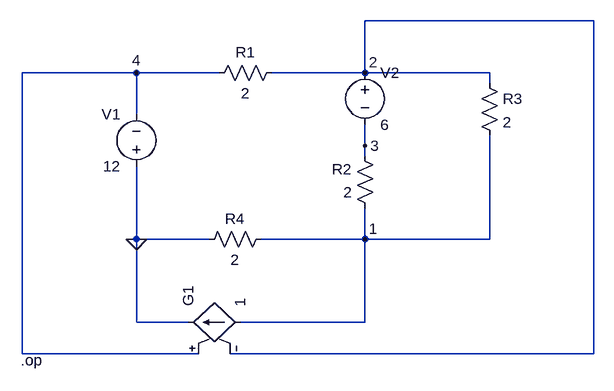
[diagram p0: schematic ex3.asc]
ex3.asc, the LTspice schematic file:
Version 4
SHEET 1 880 680
WIRE 544 -16 192 -16
WIRE -160 64 -336 64
WIRE -32 64 -160 64
WIRE 192 64 192 -16
WIRE 192 64 48 64
WIRE 384 64 192 64
WIRE 384 80 384 64
WIRE -160 128 -160 64
WIRE 192 176 192 144
WIRE 192 192 192 176
WIRE -160 320 -160 208
WIRE -48 320 -160 320
WIRE 192 320 192 272
WIRE 192 320 32 320
WIRE 384 320 384 160
WIRE 384 320 192 320
WIRE -160 448 -160 320
WIRE -80 448 -160 448
WIRE 192 448 192 320
WIRE 192 448 0 448
WIRE -336 496 -336 64
WIRE -64 496 -336 496
WIRE 544 496 544 -16
WIRE 544 496 -16 496
FLAG -160 320 0
FLAG 192 320 1
FLAG 192 64 2
FLAG 192 176 3
FLAG -160 64 4
SYMBOL res 64 48 R90
WINDOW 0 0 56 VBottom 2
WINDOW 3 32 56 VTop 2
SYMATTR InstName R1
SYMATTR Value 2
SYMBOL res 208 288 R180
WINDOW 0 36 76 Left 2
WINDOW 3 36 40 Left 2
SYMATTR InstName R2
SYMATTR Value 2
SYMBOL res 368 64 R0
SYMATTR InstName R3
SYMATTR Value 2
SYMBOL res 48 304 R90
WINDOW 0 0 56 VBottom 2
WINDOW 3 32 56 VTop 2
SYMATTR InstName R4
SYMATTR Value 2
SYMBOL voltage -160 224 R180
WINDOW 0 24 96 Left 2
WINDOW 3 24 16 Left 2
WINDOW 123 0 0 Left 0
WINDOW 39 0 0 Left 0
SYMATTR InstName V1
SYMATTR Value 12
SYMBOL voltage 192 48 R0
WINDOW 123 0 0 Left 0
WINDOW 39 0 0 Left 0
SYMATTR InstName V2
SYMATTR Value 6
SYMBOL g -96 448 R270
SYMATTR InstName G1
SYMATTR Value 1
TEXT -338 506 Left 2 !.op

The netlist it stands for:
* ex3.asc
R1 2 4 2
R2 1 3 2
R3 2 1 2
R4 1 0 2
V1 0 4 12
V2 2 3 6
G1 1 0 4 2 1
.op
.backanno
.end